# Altium schematic sheet DisplayConn.SchDoc
size 431 x 279 mm; Organization: ORGANIZATION; Address1: ADDRESS 1; Address2: ADDRESS 2; Address3: ADDRESS 3; Address4: ADDRESS 4; Revision: -; SheetNumber: 3; SheetTotal: 5; ENG_APP_DATE: --/--/--; DSN_APP_DATE: --/--/--; CHK_APP_DATE: --/--/--
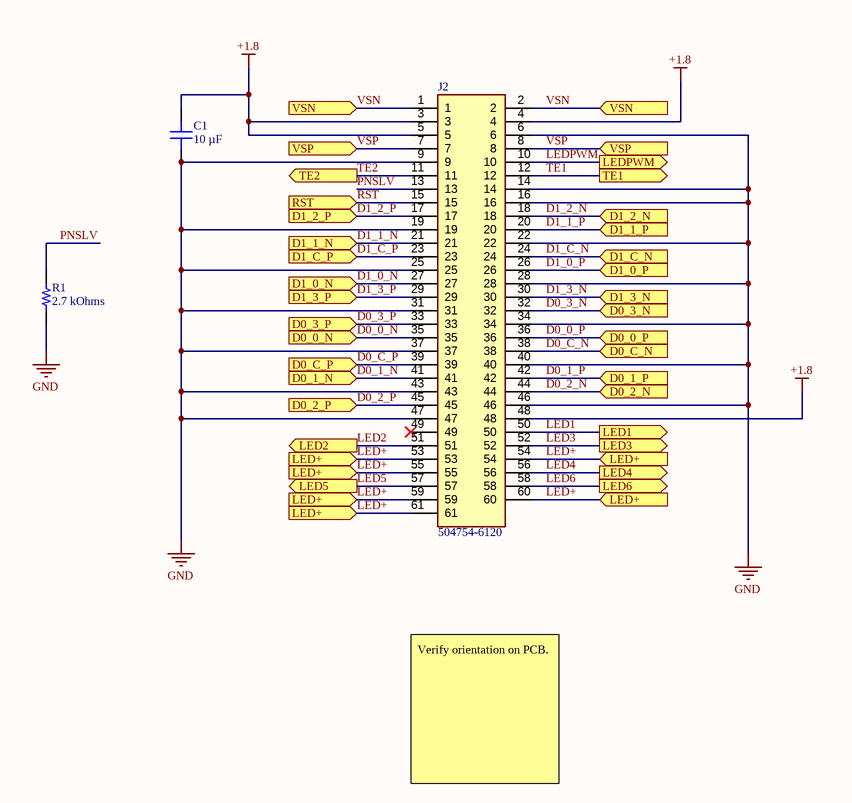
[diagram p0: DisplayConn.SchDoc]

## Parts
C1  10 µF  [CAP 0603_1608]
J2  504754-6120  [5047546120]
R1  2.7 kOhms  [RES 0201_0603]

## Ports
D0_0_N (in), D0_0_P (in), D0_1_N (in), D0_1_P (in), D0_2_N (in), D0_2_P (in), D0_3_N (in), D0_3_P (in), D0_C_N (in), D0_C_P (in), D1_0_N (in), D1_0_P (in), D1_1_N (in), D1_1_P (in), D1_2_N (in), D1_2_P (in), D1_3_N (in), D1_3_P (in), D1_C_N (in), D1_C_P (in), LED1 (out), LED2 (out), LED3 (out), LED4 (out), LED5 (out), LED6 (out), LED+ (in), LEDPWM (out), RST (in), TE1 (out), TE2 (out), VSN (in), VSP (in)

## Nets
+1.8: C1.2 J2.3 J2.4 J2.5 J2.48
GND: C1.1 J2.6 J2.9 J2.14 J2.16 J2.19 J2.22 J2.25 J2.28 J2.31 J2.34 J2.37 J2.40 J2.43 J2.46 J2.47 R1.1
D0_0_N: J2.35 ; port D0_0_N
D0_0_P: J2.36 ; port D0_0_P
D0_1_N: J2.41 ; port D0_1_N
D0_1_P: J2.42 ; port D0_1_P
D0_2_N: J2.44 ; port D0_2_N
D0_2_P: J2.45 ; port D0_2_P
D0_3_N: J2.32 ; port D0_3_N
D0_3_P: J2.33 ; port D0_3_P
D0_C_N: J2.38 ; port D0_C_N
D0_C_P: J2.39 ; port D0_C_P
D1_0_N: J2.27 ; port D1_0_N
D1_0_P: J2.26 ; port D1_0_P
D1_1_N: J2.21 ; port D1_1_N
D1_1_P: J2.20 ; port D1_1_P
D1_2_N: J2.18 ; port D1_2_N
D1_2_P: J2.17 ; port D1_2_P
D1_3_N: J2.30 ; port D1_3_N
D1_3_P: J2.29 ; port D1_3_P
D1_C_N: J2.24 ; port D1_C_N
D1_C_P: J2.23 ; port D1_C_P
LED1: J2.50 ; port LED1
LED2: J2.51 ; port LED2
LED3: J2.52 ; port LED3
LED4: J2.56 ; port LED4
LED5: J2.57 ; port LED5
LED6: J2.58 ; port LED6
LED+: J2.53 J2.54 J2.55 J2.59 J2.60 J2.61 ; port LED+
LEDPWM: J2.10 ; port LEDPWM
PNSLV: J2.13 R1.2
RST: J2.15 ; port RST
TE1: J2.12 ; port TE1
TE2: J2.11 ; port TE2
VSN: J2.1 J2.2 ; port VSN
VSP: J2.7 J2.8 ; port VSP

Not connected (* = marked no-connect by the designer): J2 49*

## Notes on the sheet
- Verify orientation on PCB.
- DWG. NO.
- REV.
- SHT.
- REVISION
- DESCRIPTION
- DATE
- APPROVED
- ENG:
- APPROVALS
- PROJECT
- DSN:
- CHK:
- REFERENCE DOCUMENTS
- PROJECT REVISION:
- TITLE
- SimulaVR
- DOCUMENT REVISION:
- DESIGN ITEM:
- BOM:
- FAB DWG:
- PCB DWG:
- ASSY DWG:
- SCALE:
- SIZE
- B
- CAGE CODE
- FILE NAME
- DWG NO.
- SHEET
- OF
- REV

## Library data of the parts
C1 = GRM188R61C106MA73D: CAP CER 10UF 16V X5R 0603; manufacturer: Murata Electronics; Tolerance: ±20%; Part Number: GRM188R61C106MA73D; Value: 10 µF; Applications: General Purpose; Capacitance: 10 µF; componentlink1description: Datasheet; componentlink1url: https://www.murata.com/~/media/webrenewal/support/library/catalog/products/capacitor/mlcc/c02e.ashx?la=en-us; componentlink2description: DigiKey Link; componentlink2url: https://www.digikey.com/en/products/detail/murata-electronics/GRM188R61C106MA73D/3900480; Device Package: 0603 (1608 Metric); lastupdated: 2022-04-02 05:55:00; Lifecycle Status: Active; Minimum Order: 1; Mounting Type: Surface Mount, MLCC; Operating Temperature: -55°C ~ 85°C; Package / Case: 0603 (1608 Metric); packaging: TapeAndReel; partid: 15141; Part Status: Active; price: 0.04; series: GRM; Size / Dimension: 0.063" L x 0.031" W (1.60mm x 0.80mm); Supplier 1: DigiKey; Supplier Part Number 1: 490-7201-1-ND; Temperature Coefficient: X5R; Thickness (Max): 0.039" (1.00mm); Voltage - Rated: 16V
J2 = 504754-6120: Connector; Manufacturer_Name: Molex; Datasheet Link: https://componentsearchengine.com/Datasheets/1/504754-6120.pdf; Height: 1.67mm; Manufacturer_Part_Number: 504754-6120; Mouser Part Number: 538-504754-6120; Mouser Price/Stock: https://www.mouser.com/Search/Refine.aspx?Keyword=538-504754-6120
R1 = ERJ-U01J272C: RES 2.7K OHM 5% 1/20W 0201 SMD; Manufacturer: Panasonic Electronic Components; Power (Watts): 0.05W, 1/20W; Temperature Coefficient: ±200ppm/°C; Part Number: ERJ-U01J272C; Value: 2.7 kOhms; ComponentLink1Description: Datasheet; ComponentLink1URL: https://industrial.panasonic.com/cdbs/www-data/pdf/RDP0000/AOA0000C334.pdf; ComponentLink2Description: DigiKey Link; ComponentLink2URL: https://www.digikey.com/en/products/detail/panasonic-electronic-components/ERJ-U01J272C/11641374; Composition: Thick Film; Device Package: 0201 (0603 Metric); Features: Anti-Sulfur; Height - Seated (Max): 0.010" (0.26mm); LastUpdated: 2022-04-12 22:15:26; Lifecycle Status: Active; Minimum Order: 1; Number of Terminations: 2; Operating Temperature: -55°C ~ 125°C; Package / Case: 0201 (0603 Metric); Packaging: TapeAndReel; PartId: 64645; Part Status: Active; Price: 0.04; Resistance: 2.7 kOhms; Series: ERJ-U01; Size / Dimension: 0.024" L x 0.012" W (0.60mm x 0.30mm); Supplier 1: DigiKey; Supplier Part Number 1: 10-ERJ-U01J272CCT-ND; Supplier Device Package: 0201; Tolerance: ±5%